# Altium schematic sheet Top.SchDoc
size A4
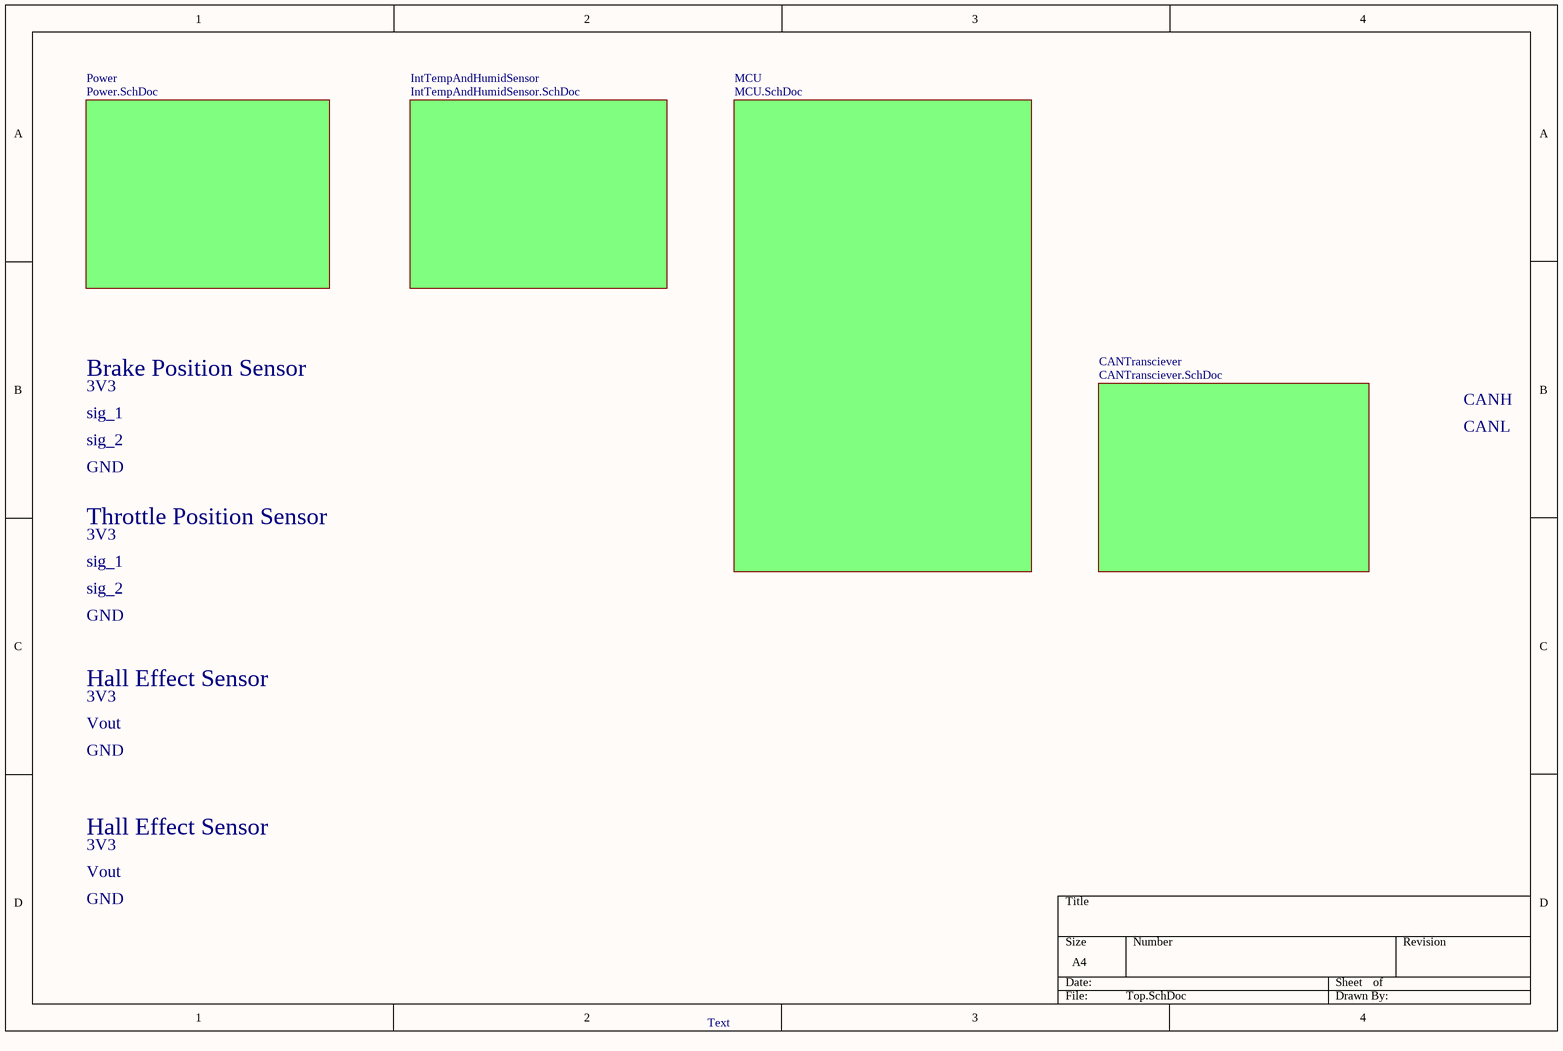
[diagram p0: Top.SchDoc]

## Sub-sheets
CANTransciever = CANTransciever.SchDoc: no entries
IntTempAndHumidSensor = IntTempAndHumidSensor.SchDoc: no entries
MCU = MCU.SchDoc: no entries
Power = Power.SchDoc: no entries

## Notes on the sheet
- Brake Position Sensor
- 3V3
- sig_1
- sig_2
- CANH
- CANL
- GND
- Throttle Position Sensor
- Hall Effect Sensor
- Vout
- Text